# EasyEDA schematic Agriculture iot_2020-07-04_16-49-31.json
TITLE: AGRICULTURE IOT SCHEMATIC; REV: 1.0; Date: 2020-07-03; Sheet: 1/1; Drawn By: SHOAIB; Company: MECTEC
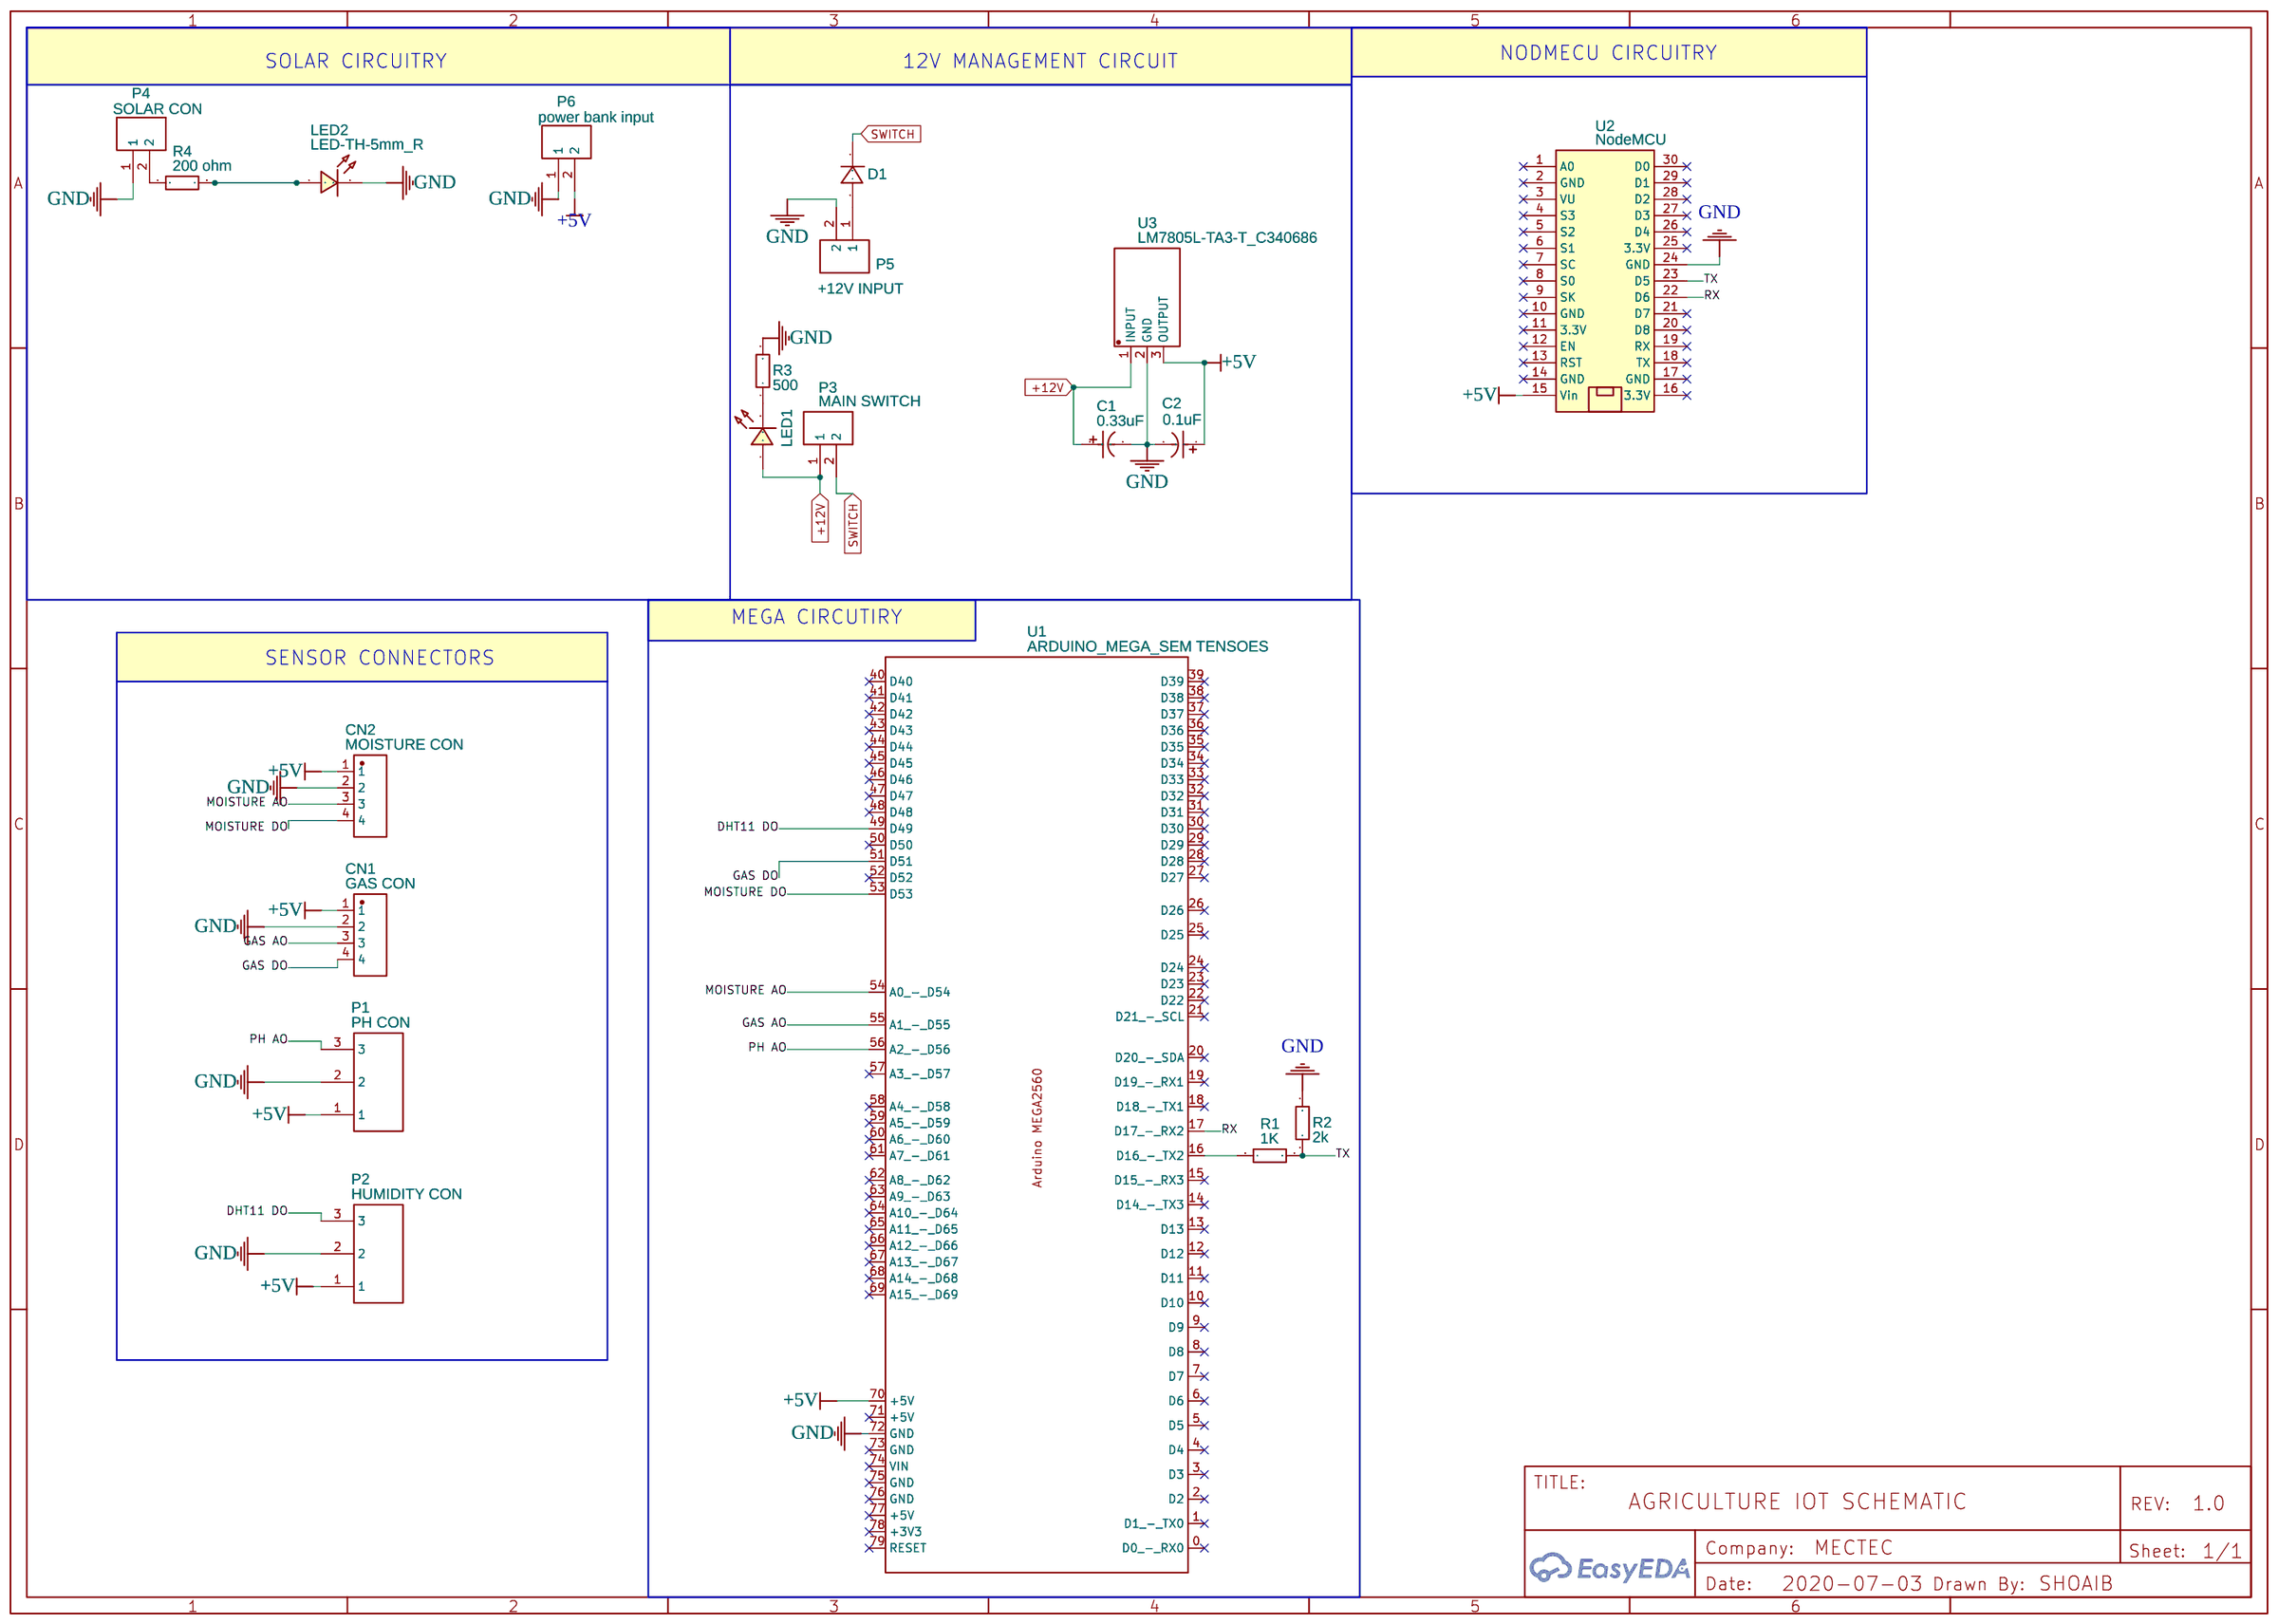
[diagram p0: schematic sheet]

## Parts
C1  0.33uF  [CAP-TH_BD4.0-P1.50-D0.8-FD]
C2  0.1uF  [CAP-TH_BD4.0-P1.50-D0.8-FD]
CN1  GAS CON  [CONN-TH_4P-P5.00_WJ127-5.0-4P]
CN2  MOISTURE CON  [CONN-TH_4P-P5.00_WJ127-5.0-4P]
D1  1N4001_C331627  [DO-41_BD2.4-L4.7-P8.70-D0.9-RD]
LED1  LED-TH-5mm_R  [LED-TH_BD5.0_RED]
LED2  LED-TH-5mm_R  [LED-TH_BD5.0_RED]
P1  PH CON  [CONN-TH_2P-P5.00_WJ301V-5.00-3P]
P2  HUMIDITY CON  [CONN-TH_2P-P5.00_WJ301V-5.00-3P]
P3  MAIN SWITCH  [CONN-TH_2P-P5.00_WJ301V-5.00-2P]
P4  SOLAR CON  [CONN-TH_2P-P5.00_WJ301V-5.00-2P]
P5  +12V INPUT  [CONN-TH_2P-P5.00_WJ301V-5.00-2P]
P6  power bank input  [CONN-TH_2P-P5.00_WJ301V-5.00-2P]
R1  1K  [RES-TH_BD2.3-L6.5-P10.50-D0.5]
R2  2k  [RES-TH_BD2.3-L6.5-P10.50-D0.5]
R3  500  [RES-TH_BD2.3-L6.5-P10.50-D0.5]
R4  200 ohm  [RES-TH_BD2.3-L6.5-P10.50-D0.5]
U1  ARDUINO_MEGA_SEM TENSOES  [ARDUINO_MEGA_SHIELD_PCB]
U2  NodeMCU  [NODEMCU V3 LOLIN]
U3  LM7805L-TA3-T_C340686  [TO-220IS_L10.16-W4.7-P2.54-L]

## Library data of the parts
C1 C2 = 22uF 25V 4*7: Supplier: LCSC; Manufacturer: ValuePro; Supplier Part: C43840
CN1 = WJ127-5.0-4P: Supplier: LCSC; Supplier Part: C192779; Manufacturer: Ningbo Kangnex Elec; Contributor: LCSC
CN2 = WJ127-5.0-4P: Supplier: LCSC; Supplier Part: C192779; Manufacturer: Ningbo Kangnex Elec; Contributor: LCSC; Package Display: No
D1 = 1N4001_C331627: Supplier: LCSC; Supplier Part: C331627; Manufacturer: GW; Manufacturer Part: 1N4001; Contributor: LCSC
LED1 LED2 = LED-TH-5mm_R: Manufacturer: EVERLIGHT(台湾亿光); Manufacturer Part: 333-2SURD/S530-A3; Supplier Part: C87271; Supplier: LCSC; Contributor: LCEDA_Lib
P1 P2 = WJ301V-5.0-3P: Supplier: LCSC; Manufacturer: ReliaPro; image: //image.lceda.cn/szlcsc/C8483.jpg; Supplier Part: C8483
P3-P6 = WJ301V-5.0-2P: Supplier: LCSC; Manufacturer: ReliaPro; image: //image.lceda.cn/szlcsc/C8475.jpg; Supplier Part: C8475
R1-R4 = CF1/4W-1KΩ±5% T52: Supplier: LCSC; Supplier Part: C120055; Manufacturer: Chian Chia Elec; Contributor: LCSC
U1 = ARDUINO_MEGA_SEM TENSOES: Manufacturer Part: ArduinoMega2560; Contributor: Gianluca Tenni; Supplier: RS-Online; Manufacturer: ARDUINO
U2 = NodeMCU: Manufacturer Part: NodeMcu V3 LoLin; Contributor: Ajay V.P.
U3 = LM7805L-TA3-T_C340686: Supplier: LCSC; Supplier Part: C340686; Manufacturer: Unisonic Tech; Manufacturer Part: LM7805L-TA3-T; Contributor: LCSC

## Nets
+5V: C2.1 CN1.1 CN2.1 P1.1 P2.1 P6.2 U1.70(+5V) U2.15(Vin) U3.3(OUTPUT)
+12V: C1.1 LED1.1 P3.1 U3.1(INPUT)
GND: C1.2 C2.2 CN1.2 CN2.2 LED2.2 P1.2 P2.2 P4.1 P5.2 P6.1 R2.2 R3.2 U1.72(GND) U2.24(GND) U3.2(GND)
DHT11 DO: P2.3 U1.49(D49)
GAS AO: CN1.3 U1.55(A1 - D55)
GAS DO: CN1.4 U1.51(D51)
MOISTURE AO: CN2.3 U1.54(A0 - D54)
MOISTURE DO: CN2.4 U1.53(D53)
PH AO: P1.3 U1.56(A2 - D56)
RX: U1.17(D17 - RX2) U2.22(D6)
SWITCH: D1.1(C) P3.2
TX: R1.2 R2.1 U2.23(D5)
Net-(D1-2): D1.2(A) P5.1
Net-(LED1-2): LED1.2 R3.1
Net-(LED2-1): LED2.1 R4.2
Net-(P4-2): P4.2 R4.1
Net-(R1-1): R1.1 U1.16(D16 - TX2)

Not connected (* = marked no-connect by the designer): U1 0(D0 - RX0)* 1(D1 - TX0)* 2(D2)* 3(D3)* 4(D4)* 5(D5)* 6(D6)* 7(D7)* 8(D8)* 9(D9)* 10(D10)* 11(D11)* 12(D12)* 13(D13)* 14(D14 - TX3)* 15(D15 - RX3)* 18(D18 - TX1)* 19(D19 - RX1)* 20(D20 - SDA)* 21(D21 - SCL)* 22(D22)* 23(D23)* 24(D24)* 25(D25)* 26(D26)* 27(D27)* 28(D28)* 29(D29)* 30(D30)* 31(D31)* 32(D32)* 33(D33)* 34(D34)* 35(D35)* 36(D36)* 37(D37)* 38(D38)* 39(D39)* 40(D40)* 41(D41)* 42(D42)* 43(D43)* 44(D44)* 45(D45)* 46(D46)* 47(D47)* 48(D48)* 50(D50)* 52(D52)* 57(A3 - D57)* 58(A4 - D58)* 59(A5 - D59)* 60(A6 - D60)* 61(A7 - D61)* 62(A8 - D62)* 63(A9 - D63)* 64(A10 - D64)* 65(A11 - D65)* 66(A12 - D66)* 67(A13 - D67)* 68(A14 - D68)* 69(A15 - D69)* 71(+5V)* 73(GND)* 74(VIN)* 75(GND)* 76(GND)* 77(+5V)* 78(+3V3)* 79(RESET)*; U2 1(A0)* 2(GND)* 3(VU)* 4(S3)* 5(S2)* 6(S1)* 7(SC)* 8(S0)* 9(SK)* 10(GND)* 11(3.3V)* 12(EN)* 13(RST)* 14(GND)* 16(3.3V)* 17(GND)* 18(TX)* 19(RX)* 20(D8)* 21(D7)* 25(3.3V)* 26(D4)* 27(D3)* 28(D2)* 29(D1)* 30(D0)*

## Notes on the sheet
- SOLAR CIRCUITRY
- 12V MANAGEMENT CIRCUIT
- NODMECU CIRCUITRY
- MEGA CIRCUTIRY
- SENSOR CONNECTORS
